# Altium schematic sheet ETH_PHY.SchDoc
size A4
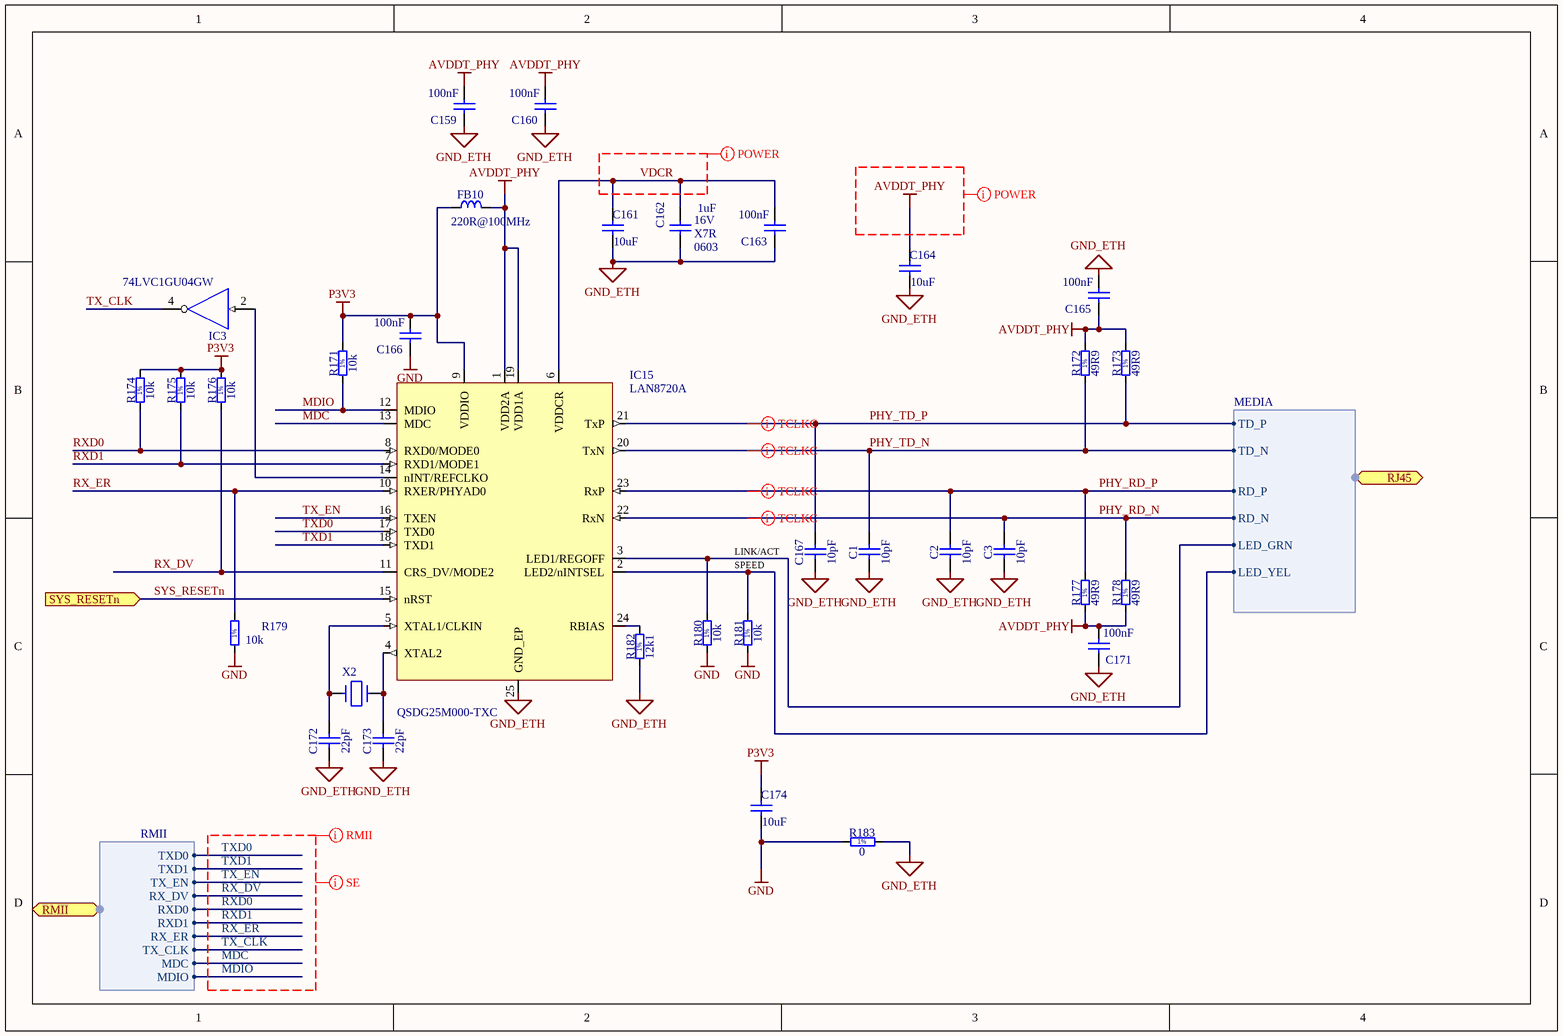
[diagram p0: ETH_PHY.SchDoc]

## Parts
C1  10pF  [CAPC1005X55N]
C2  10pF  [CAPC1005X55N]
C3  10pF  [CAPC1005X55N]
C159  100nF  [CAPC0603X33N]
C160  100nF  [CAPC0603X33N]
C161  10uF  [CAPC2012X135N]
C162  1uF  Voltage: 16V  TC: X7R  Case: 0603  [CAPC1608X87N]
C163  100nF  [CAPC0603X33N]
C164  10uF  [CAPC2012X135N]
C165  100nF  [CAPC0603X33N]
C166  100nF  [CAPC0603X33N]
C167  10pF  [CAPC1005X55N]
C171  100nF  [CAPC0603X33N]
C172  22pF  [CAPC1005X55N]
C173  22pF  [CAPC1005X55N]
C174  10uF  [CAPC2012X135N]
FB10  220R@100MHz  [INDC2012X105N]
IC3  74LVC1GU04GW  [SOT65P212X110-5N]
IC15  LAN8720A  [QFN24-TP]
R171  10k  [RESC1005X40N]
R172  49R9  [RESC1005X40N]
R173  49R9  [RESC1005X40N]
R174  10k  [RESC1005X40N]
R175  10k  [RESC1005X40N]
R176  10k  [RESC1005X40N]
R177  49R9  [RESC1005X40N]
R178  49R9  [RESC1005X40N]
R179  10k  [RESC1005X40N]
R180  10k  [RESC1005X40N]
R181  10k  [RESC1005X40N]
R182  12k1  [RESC1005X40N]
R183  0  [RESC1608X55N]
X2  QSDG25M000-TXC  [XTAL_5.0*3.2]

## Ports
RJ45 (harness MEDIA), RMII (harness RMII), SYS_RESETn (in)

## Harnesses
RMII: TXD0, TXD1, TX_EN, RX_DV, RXD0, RXD1, RX_ER, TX_CLK, MDC, MDIO
MEDIA: TD_P, TD_N, RD_P, RD_N, LED_GRN, LED_YEL

## Nets
AVDDT_PHY: C159.2 C160.2 C164.1 C165.1 C171.2 FB10.2 IC15.1(VDD2A) IC15.19(VDD1A) R172.2 R173.2 R177.1 R178.1
GND: C166.1 C174.2 IC3.3(GND) R179.1 R180.1 R181.1 R183.1
GND_ETH: C1.1 C2.1 C3.1 C159.1 C160.1 C161.2 C162.1 C163.1 C164.2 C165.2 C167.1 C171.1 C172.1 C173.1 IC15.25(GND_EP) R182.1 R183.2
P3V3: C166.2 C174.1 FB10.1 IC3.5(VCC) IC15.9(VDDIO) R171.2 R174.2 R175.2 R176.2
MDC: IC15.13(MDC) ; port RMII.MDC
MDIO: IC15.12(MDIO) R171.1 ; port RMII.MDIO
PHY_RD_N: C3.2 IC15.22(RxN) R178.2 ; port RJ45.RD_N
PHY_RD_P: C2.2 IC15.23(RxP) R177.2 ; port RJ45.RD_P
PHY_TD_N: C1.2 IC15.20(TxN) R172.1 ; port RJ45.TD_N
PHY_TD_P: C167.2 IC15.21(TxP) R173.1 ; port RJ45.TD_P
RX_DV: IC15.11(CRS_DV/MODE2) R176.1 ; port RMII.RX_DV
RX_ER: IC15.10(RXER/PHYAD0) R179.2 ; port RMII.RX_ER
RXD0: IC15.8(RXD0/MODE0) R174.1 ; port RMII.RXD0
RXD1: IC15.7(RXD1/MODE1) R175.1 ; port RMII.RXD1
SYS_RESETn: IC15.15(nRST) ; port SYS_RESETn
TX_CLK: IC3.4(OUT) ; port RMII.TX_CLK
TX_EN: IC15.16(TXEN) ; port RMII.TX_EN
TXD0: IC15.17(TXD0) ; port RMII.TXD0
TXD1: IC15.18(TXD1) ; port RMII.TXD1
VDCR: C161.1 C162.2 C163.2 IC15.6(VDDCR)
NetC172_2: C172.2 IC15.5(XTAL1/CLKIN) X2.1
NetC173_2: C173.2 IC15.4(XTAL2) X2.2
NetIC3_2: IC3.2(IN) IC15.14(nINT/REFCLKO)
NetIC15_2: IC15.2(LED2/nINTSEL) R181.2 ; port RJ45.LED_YEL
NetIC15_3: IC15.3(LED1/REGOFF) R180.2 ; port RJ45.LED_GRN
NetIC15_24: IC15.24(RBIAS) R182.2

## Layout directives
differential pair: PHY_RD_N, PHY_RD_P, PHY_TD_N, PHY_TD_P
net class RMII: MDC, MDIO, RX_DV, RX_ER, RXD0, RXD1, TX_CLK, TX_EN, TXD0, TXD1
net class SE: MDC, MDIO, RX_DV, RX_ER, RXD0, RXD1, TX_CLK, TX_EN, TXD0, TXD1
net class POWER: AVDDT_PHY, VDCR

## Notes on the sheet
- SPEED
- LINK/ACT
- (in symbol R0402_10K_1%_0.0625W_100PPM) 1%
- (in symbol R0402_12K1_1%_0.0625W_100PPM) 1%
- (in symbol R0402_49R9_1%_0.0625W_100PPM) 1%
- (in symbol R0603_0R_JUMPER) 1%

## Library data of the parts
C1-C3 C167 = CC0402_10PF_50V_5%_NP0: Non-polarised capacitor; Part Description: SMD Multilayer Chip Ceramic Capacitor; Manufacturer: GENERIC; Manufacturer1 Part Number: 223886915109; Voltage: 50V; TC: NP0; Tolerance: ±5%; Table: Capacitors SMD; Part Number: CC0402_10PF_50V_5%_NP0; Component Kind: Standard; Component Type: Standard; Pin Count: 2; Value: 10pF; Status: Not Recommended; Manufacturer Part Number: CC0402_10PF_50V_5%_NP0; Case: 0402; Mounted: Yes; Socket: No; SMD: Yes; Manufacturer1 Example: PHYCOMP; Manufacturer1 ComponentHeight: 0.55mm; HelpURL: \\cern.ch\dfs\Applications\Altium\Datasheets\CC0402_NP0_PHYCOMP.pdf; Author: CERN DEM JLC; CreateDate: 2007-12-03; LatestRevisionDate: 2007-12-03
C159 C160 C163 C165 C166 C171 = CC0201_100NF_6.3V_10%_X5R: Non-polarised capacitor; Part Description: SMD Multilayer Chip Ceramic Capacitor; Manufacturer: GENERIC; Manufacturer1 Part Number: 02016D104KAT2A; Voltage: 6.3V; TC: X5R; Tolerance: ±10%; Table: Capacitors SMD; Part Number: CC0201_100NF_6.3V_10%_X5R; Component Kind: Standard; Component Type: Standard; Pin Count: 2; Value: 100nF; Status: Not Recommended; Manufacturer Part Number: CC0201_100NF_6.3V_10%_X5R; Case: 0201; Mounted: Yes; Socket: No; SMD: Yes; Manufacturer1 Example: AVX; Manufacturer1 ComponentHeight: 0.33mm; HelpURL: \\cern.ch\dfs\Applications\Altium\Datasheets\CC0201_X5R_AVX.pdf; Author: CERN DEM JLC; CreateDate: 2007-12-03; LatestRevisionDate: 2007-12-03
C161 C164 C174 = CC0805_10UF_10V_10%_X7R: Non-polarised capacitor; Part Description: SMD Multilayer Chip Ceramic Capacitor; Manufacturer: GENERIC; Manufacturer1 Part Number: GRM21BR71A106KE51L; Voltage: 10V; TC: X7R; Tolerance: ±10%; Table: Capacitors SMD; Part Number: CC0805_10UF_10V_10%_X7R; Component Kind: Standard; Component Type: Standard; Pin Count: 2; Value: 10uF; Status: Preferred; Manufacturer Part Number: CC0805_10UF_10V_10%_X7R; Case: 0805; Mounted: Yes; Socket: No; SMD: Yes; Manufacturer1 Example: MURATA; Manufacturer1 ComponentHeight: 1.35mm; HelpURL: \\cern.ch\dfs\Applications\Altium\Datasheets\CC0805_X7R_MURATA.pdf; Author: CERN DEM JLC; CreateDate: 2012-04-30; LatestRevisionDate: 2012-04-30
C162 = CC0603_1UF_16V_10%_X7R: Non-polarised capacitor; Part Description: SMD Multilayer Chip Ceramic Capacitor; Manufacturer: GENERIC; Manufacturer1 Part Number: 223824613663; Tolerance: ±10%; Table: Capacitors SMD; Part Number: CC0603_1UF_16V_10%_X7R; Component Kind: Standard; Component Type: Standard; Pin Count: 2; Value: 1uF; Status: Preferred; Manufacturer Part Number: CC0603_1uF_16V_10%_X7R; Mounted: Yes; Socket: No; SMD: Yes; Manufacturer1 Example: PHYCOMP; Manufacturer1 ComponentHeight: 0.87mm; HelpURL: \\cern.ch\dfs\Applications\Altium\Datasheets\CC0805_X5R_PHYCOMP_HC.pdf; Author: CERN DEM JLC; CreateDate: 12/3/2007; LatestRevisionDate: 12/3/2007
C172 C173 = CC0402_22PF_50V_5%_NP0: Non-polarised capacitor; Part Description: SMD Multilayer Chip Ceramic Capacitor; Manufacturer: GENERIC; Manufacturer1 Part Number: 223886915229; Voltage: 50V; TC: NP0; Tolerance: ±5%; Table: Capacitors SMD; Part Number: CC0402_22PF_50V_5%_NP0; Component Kind: Standard; Component Type: Standard; Pin Count: 2; Value: 22pF; Status: Not Recommended; Manufacturer Part Number: CC0402_22PF_50V_5%_NP0; Case: 0402; Mounted: Yes; Socket: No; SMD: Yes; Manufacturer1 Example: PHYCOMP; Manufacturer1 ComponentHeight: 0.55mm; HelpURL: \\cern.ch\dfs\Applications\Altium\Datasheets\CC0402_NP0_PHYCOMP.pdf; Author: CERN DEM JLC; CreateDate: 2007-12-03; LatestRevisionDate: 2007-12-03
FB10 = IND0805_MURATA_BLM21PG221SN1D: Inductor; Part Description: SMD EMIFIL Suppression Chip Ferrite Bead; Manufacturer: MURATA; Power: 2A; Resistance: 0.05R; Tolerance: ±25%; Table: Inductors SMD; Part Number: IND0805_MURATA_BLM21PG221SN1D; Component Kind: Standard; Component Type: Standard; Pin Count: 2; Value: 220R@100MHz; Status: None; Manufacturer Part Number: BLM21PG221SN1D; Case: 0805; Mounted: Yes; Socket: No; SMD: Yes; ComponentHeight: 1.05mm; HelpURL: \\cern.ch\dfs\Applications\Altium\Datasheets\IND0402_MURATA_BLM21P.pdf; Author: CERN DEM JLC; CreateDate: 2010-01-25; LatestRevisionDate: 2010-01-25
IC3 = 74LVC1GU04GW: Single Inverter Buffer; Manufacturer: NXP SEMICONDUCTORS; Table: Standard Logic; Part Number: 74LVC1GU04GW; Component Kind: Standard; Component Type: Standard; Device: 74LVC1GU04GW; PackageDescription: SOT353, SOT, 0.65mm Pitch, 5 pin, 1.25mm W X 2.05mm L X 1.10mm H, IPC Medium Density; Part Description: Inverter; Manufacturer Part Number: 74LVC1GU04GW; Pin Count: 3; Case: SOT353; Mounted: Yes; Socket: No; SMD: Yes; ComponentHeight: 1.1mm; Author: CERN DEM JLC; HelpURL: \\cern.ch\dfs\Applications\Altium\Datasheets\74LVC1GU04GW.pdf; CreateDate: 2011-01-11; LatestRevisionDate: 2011-01-11
IC15 = IFC_LAN8710A: RMII ethernet transceiver with auto MIDIX
R171 R174-R176 R179-R181 = R0402_10K_1%_0.0625W_100PPM: Resistor - 1%; Part Description: General Purpose Thick Film Chip Resistor; Manufacturer: GENERIC; Manufacturer1 Part Number: 232270671003L; TC: ±100ppm/°C; Table: Resistors SMD; Part Number: R0402_10K_1%_0.0625W_100PPM; Component Kind: Standard; Component Type: Standard; Pin Count: 2; Value: 10k; Status: Not recommended; Power: 0.0625W; Tolerance: ±1%; Manufacturer Part Number: R0402_10K_1%_0.0625W_100PPM; Case: 0402; Mounted: Yes; Socket: No; SMD: Yes; Manufacturer1 Example: YAGEO PHYCOMP; Manufacturer1 ComponentHeight: 0.4mm; HelpURL: \\cern.ch\dfs\Applications\Altium\Datasheets\R0402_Phycomp_RC0402.pdf; Author: CERN DEM JLC; CreateDate: 2007-12-03; LatestRevisionDate: 2012-10-17
R172 R173 R177 R178 = R0402_49R9_1%_0.0625W_100PPM: Resistor - 1%; Part Description: General Purpose Thick Film Chip Resistor; Manufacturer: GENERIC; Manufacturer1 Part Number: 232270674999L or RC0402FR-0749R9L; TC: ±100ppm/°C; Table: Resistors SMD; Part Number: R0402_49R9_1%_0.0625W_100PPM; Component Kind: Standard; Component Type: Standard; Pin Count: 2; Value: 49R9; Status: Not recommended; Power: 0.0625W; Tolerance: ±1%; Manufacturer Part Number: R0402_49R9_1%_0.0625W_100PPM; Case: 0402; Mounted: Yes; Socket: No; SMD: Yes; Manufacturer1 Example: YAGEO PHYCOMP; Manufacturer1 ComponentHeight: 0.4mm; HelpURL: \\cern.ch\dfs\Applications\Altium\Datasheets\R0402_Phycomp_RC0402.pdf; Author: CERN DEM JLC; CreateDate: 2012-10-24; LatestRevisionDate: 2012-10-24
R182 = R0402_12K1_1%_0.0625W_100PPM: Resistor - 1%; Part Description: General Purpose Thick Film Chip Resistor; Manufacturer: GENERIC; Manufacturer1 Part Number: 232270671213L or RC0402FR-0712K1L; TC: ±100ppm/°C; Table: Resistors SMD; Part Number: R0402_12K1_1%_0.0625W_100PPM; Component Kind: Standard; Component Type: Standard; Pin Count: 2; Value: 12k1; Status: Not recommended; Power: 0.0625W; Tolerance: ±1%; Manufacturer Part Number: R0402_12K1_1%_0.0625W_100PPM; Case: 0402; Mounted: Yes; Socket: No; SMD: Yes; Manufacturer1 Example: YAGEO PHYCOMP; Manufacturer1 ComponentHeight: 0.4mm; HelpURL: \\cern.ch\dfs\Applications\Altium\Datasheets\R0402_Phycomp_RC0402.pdf; Author: CERN DEM JLC; CreateDate: 2012-10-24; LatestRevisionDate: 2012-10-24
R183 = R0603_0R_JUMPER: Resistor - 1%; Part Description: 1A (0.05R Max DC Resistance) Zero Ohm Jumper; Manufacturer: GENERIC; Manufacturer1 Part Number: NRC06Z0; Table: Resistors SMD; Part Number: R0603_0R_JUMPER; Component Kind: Standard; Component Type: Standard; Pin Count: 2; Value: 0; Status: Preferred; Manufacturer Part Number: R0603_0R_JUMPER; Case: 0603; Mounted: Yes; Socket: No; SMD: Yes; Manufacturer1 Example: NIC COMPONENT; Manufacturer1 ComponentHeight: 0.55mm; HelpURL: \\cern.ch\dfs\Applications\Altium\Datasheets\R0603_NIC_NRC.pdf; Author: CERN DEM JLC; CreateDate: 2007-12-03; LatestRevisionDate: 2008-03-13
X2 = X_CRYSTAL_SMD_5.0*3.2: miniature crystal oscillator (Maritex)